# EAGLE design Sens_BME280 (EAGLE 7.2.0)
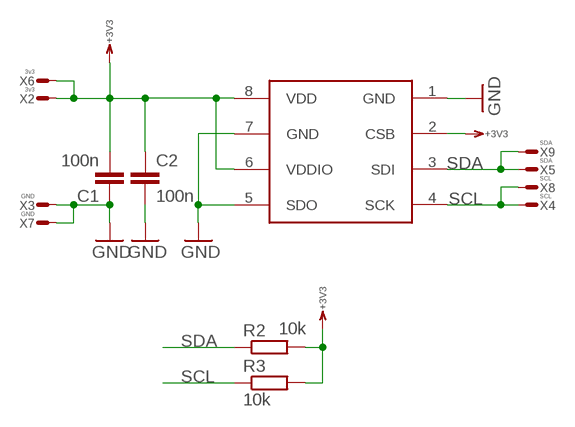
[diagram p0: schematic, sheet 1]

## Parts
C1  100n  C0603  [0603]
C2  100n  C0603  [0603]
IC1  BME280  [BME280]
R2  10k  R0603  [0603]
R3  10k  R0603  [0603]
X2  3v3  WIREPADT1.6/0.9  [T1.6/0.9]
X3  GND  WIREPADT1.6/0.9  [T1.6/0.9]
X4  SCL  WIREPADT1.6/0.9  [T1.6/0.9]
X5  SDA  WIREPADT1.6/0.9  [T1.6/0.9]
X6  3v3  WIREPADT1.6/0.9  [T1.6/0.9]
X7  GND  WIREPADT1.6/0.9  [T1.6/0.9]
X8  SCL  WIREPADT1.6/0.9  [T1.6/0.9]
X9  SDA  WIREPADT1.6/0.9  [T1.6/0.9]

## Nets
+3V3: C1.2 C2.1 IC1.2(CSB) IC1.6(VDDIO) IC1.8(VDD) R2.2 R3.2 X2.1(S) X6.1(S)
GND: C1.1 C2.2 IC1.1(GND) IC1.5(SDO) IC1.7(GND) X3.1(S) X7.1(S)
SCL: IC1.4(SCK) R3.1 X4.1(S) X8.1(S)
SDA: IC1.3(SDI) R2.1 X5.1(S) X9.1(S)

## Library data of the parts
C1 C2 = RCL:C: Capacitor SMD
IC1 = ICs:BME280
R2 R3 = RCL:R: Resistor SMD
X2-X9 = Conn:WIREPAD: Wire PAD connect wire on PCB

## Board
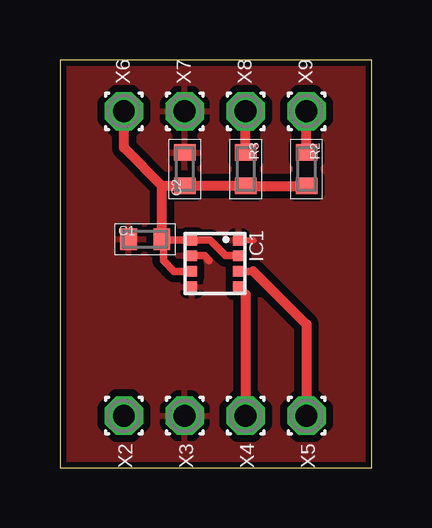
[diagram p1: board, top side]
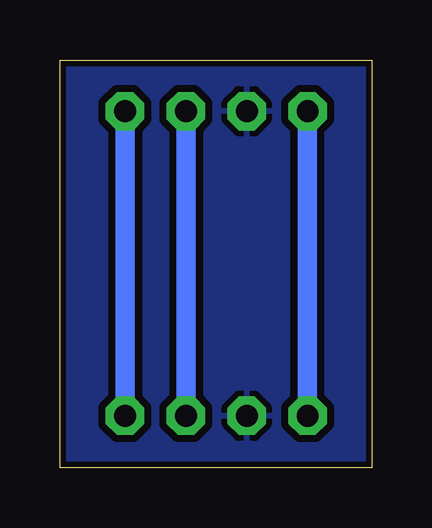
[diagram p2: board, bottom side, seen from below]

Size 13 x 17 mm. Coordinates in mm from the lower left corner, seen from the top.
Outline: 0,0 13,0 13,17 0,17 0,0
Copper layers (1*16): Top 0.035mm / dielectric 1.5mm / Bottom 0.035mm
Design rules "default": minimum track width 10mil, minimum drill 12mil, track to track 12mil, track to pad 12mil, pad to pad 12mil, via to via 12mil, smd to smd 12mil, copper to edge 10mil, drill to drill 8mil, minimum pad ring 10mil, minimum via ring 8mil, stop-mask expansion 4mil, vias tented up to drill 0mil, thermal gap 10mil

### Footprints (pad centres in the part's own frame; a part is rotated, then mirrored left to right if it is on the bottom)
0603 = smd 0.7 x 0.9: 1 -0.697,0; 2 0.697,0
BME280 = smd 0.45 x 0.45: 1 -0.975,0.975; 2 -0.325,0.975; 3 0.325,0.975; 4 0.975,0.975; 5 0.975,-0.975; 6 0.325,-0.975; 7 -0.325,-0.975; 8 -0.975,-0.975
T1.6/0.9 = drill 0.914 pad 1.6 octagon: 1 0,0

### Placement (x,y rotation side)
C1  3.56,9.53 0 top
C2  5.21,12.45 90 top
IC1  6.48,8.51 270 top
R2  10.29,12.45 270 top
R3  7.75,12.45 270 top
X2  2.67,2.16 270 top
X3  5.21,2.16 270 top
X4  7.75,2.16 270 top
X5  10.29,2.16 270 top
X6  2.67,14.86 90 top
X7  5.21,14.86 90 top
X8  7.75,14.86 90 top
X9  10.29,14.86 90 top

### Tracks (layer width: path | path; a pad name or v marks a point on that pad's centre or on a via)
+3V3
  Top 0.305: IC1.2 6.91,8.83 6.26,9.48 IC1.8 4.29,9.48 | IC1.6 4.77,8.18 4.32,8.64 4.32,9.46
  Top 0.406: R2.2 R3.2 C2.1 4.25,11.75 | X6.1 2.67,13.34 4.25,11.75 | 4.25,11.75 C1.2 4.29,9.48 4.32,9.46
  Bottom 0.813: X2.1 X6.1
GND
  Top 0.254: IC1.1 8.09,9.48
  Top 0.305: IC1.7 6.03,8.83 6.22,8.64
  pour Top: 0,17 13,17 13,0 0,0
  pour Bottom: 0,0 13,0 13,17 0,17
SCL
  Top 0.305: IC1.4 7.75,7.24
  Top 0.406: R3.1 X8.1 | 7.75,7.24 X4.1
  Bottom 0.813: X8.1 X4.1
SDA
  Top 0.305: IC1.3 8.07,8.18
  Top 0.406: R2.1 X9.1 | 8.07,8.18 10.29,5.97 X5.1
  Bottom 0.813: X9.1 X5.1